# Altium project USB转接板.PrjPcb
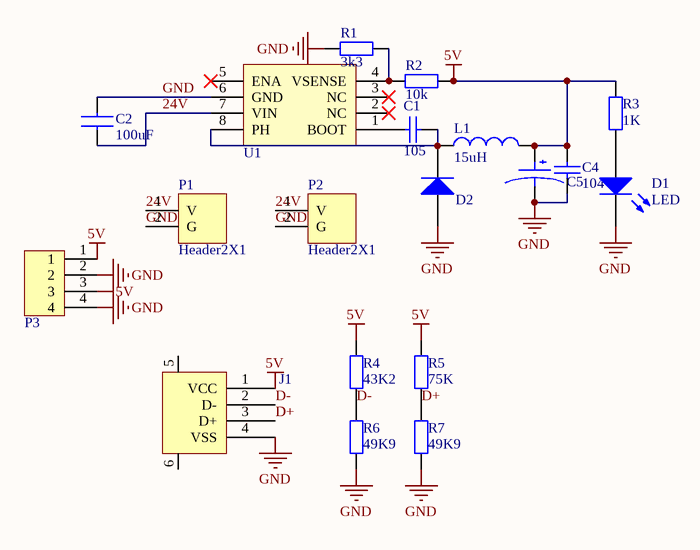
[diagram p0: USB转接板.SchDoc]
1 sheet, 19 parts. Net scope: global (net labels, ports and power ports of the same name join across sheets).
Board file: USB转接板.PcbDoc

## Sheet USB转接板.SchDoc
size A4

### Parts
C1  105  [0603C]
C2  100uF  [1201C]
C4  104  [0603C]
C5  CAP_钽220  [cap_钽E封装]  (value not drawn)
D1  LED  [LED_0603]
D2  Diode_SS34  [Diode_SS34]  (value not drawn)
J1  USB_seat  [USB_SEAT]  (value not drawn)
L1  15uH  [Inductor7.2X7.2]
P1  Header2X1  [Header_PWR_seat]
P2  Header2X1  [Header_PWR_seat]
P3  Header4  [Header4_white]  (value not drawn)
R1  3k3  [0603R]
R2  10k  [0603R]
R3  1K  [0603R]
R4  43K2  [0603R]
R5  75K  [0603R]
R6  49K9  [0603R]
R7  49K9  [0603R]
U1  TPS5430/5450  [TPS5430]  (value not drawn)

### Nets
5V: C4.2 C5.2 J1.1(VCC) L1.2 P3.1 P3.3 R2.1 R3.2 R4.2 R5.2
GND: C2.2 C4.1 C5.1 D1.2(K) D2.1(A) J1.4(VSS) P1.2(G) P2.2(G) P3.2 P3.4 R1.2 R6.1 R7.1 U1.6(GND)
24V: C2.1 P1.1(V) P2.1(V) U1.7(VIN)
D+: J1.3(D+) R5.1 R7.2
D-: J1.2(D-) R4.1 R6.2
NetC1_1: C1.1 D2.2(K) L1.1 U1.8(PH)
NetC1_2: C1.2 U1.1(BOOT)
NetD1_1: D1.1(A) R3.1
NetR1_1: R1.1 R2.2 U1.4(VSENSE)

Not connected (* = marked no-connect by the designer): J1 5 6; U1 2(NC)* 3(NC)* 5(ENA)*

### Library data of the parts
C1 = C_106: 0603/0805; Value: 105
C2 = CAP100uF: Value: 100uF
C4 = C_104: 0603/0805; Value: 104
C5 = CAP_钽220: CAP
D2 = Diode_SS34: 肖特基二极管
J1 = USB_seat: 母座
L1 = Inductor: 屏蔽电感
P1 P2 = Header2X1: power
R1-R7 = R: 0603/0805
  R1: Value: 3k3
  R2: Value: 10k
  R3: Value: 1k
  R4: Value: 43K2
  R5: Value: 75K
  R6 R7: Value: 49K9
U1 = TPS5430/5450: 降压